# EAGLE design led_display_4x7_base_panel_for_AVR_v2 (EAGLE 5.10)
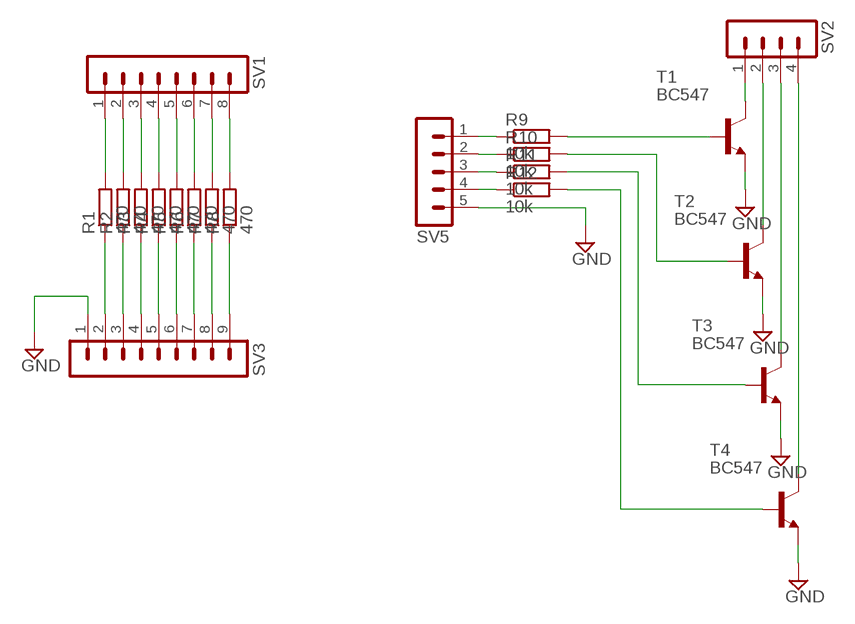
[diagram p0: schematic, sheet 1]

## Parts
R1  470  R-EU_0207/10  [0207/10]
R2  470  R-EU_0207/10  [0207/10]
R3  470  R-EU_0207/10  [0207/10]
R4  470  R-EU_0207/10  [0207/10]
R5  470  R-EU_0207/10  [0207/10]
R6  470  R-EU_0207/10  [0207/10]
R7  470  R-EU_0207/10  [0207/10]
R8  470  R-EU_0207/10  [0207/10]
R9  10k  R-EU_0207/10  [0207/10]
R10  10k  R-EU_0207/10  [0207/10]
R11  10k  R-EU_0207/10  [0207/10]
R12  10k  R-EU_0207/10  [0207/10]
SV1  MA08-1  [MA08-1]
SV2  MA04-1  [MA04-1]
SV3  MA09-1  [MA09-1]
SV5  MA05-1  [MA05-1]
T1  BC547  [TO92]
T2  BC547  [TO92]
T3  BC547  [TO92]
T4  BC547  [TO92]

## Nets
DIGIT_1_BASE: R9.2 T1.2(B)
DIGIT_1_IN: R9.1 SV5.1
DIGIT_1_N: SV2.1 T1.3(C)
DIGIT_2_BASE: R10.2 T2.2(B)
DIGIT_2_IN: R10.1 SV5.2
DIGIT_2_N: SV2.2 T2.3(C)
DIGIT_3_BASE: R11.2 T3.2(B)
DIGIT_3_IN: R11.1 SV5.3
DIGIT_3_N: SV2.3 T3.3(C)
DIGIT_4_BASE: R12.2 T4.2(B)
DIGIT_4_IN: R12.1 SV5.4
DIGIT_4_N: SV2.4 T4.3(C)
GND: SV3.1 SV5.5 T1.1(E) T2.1(E) T3.1(E) T4.1(E)
SEGMENT1: R1.2 SV1.1
SEGMENT1_1: R1.1 SV3.2
SEGMENT2: R2.2 SV1.2
SEGMENT2_1: R2.1 SV3.3
SEGMENT3: R3.2 SV1.3
SEGMENT3_1: R3.1 SV3.4
SEGMENT4: R4.2 SV1.4
SEGMENT4_1: R4.1 SV3.5
SEGMENT5: R5.2 SV1.5
SEGMENT5_1: R5.1 SV3.6
SEGMENT6: R6.2 SV1.6
SEGMENT6_1: R6.1 SV3.7
SEGMENT7: R7.2 SV1.7
SEGMENT7_1: R7.1 SV3.8
SEGMENT8: R8.2 SV1.8
SEGMENT8_1: R8.1 SV3.9

## Library data of the parts
R1-R12 = rcl:R-EU_: RESISTOR, European symbol
SV1 = con-lstb:MA08-1: PIN HEADER
SV2 = con-lstb:MA04-1: PIN HEADER
SV3 = con-lstb:MA09-1: PIN HEADER
SV5 = con-lstb:MA05-1: PIN HEADER
T1-T4 = transistor:BC547: NPN TRANSISTOR

## Board
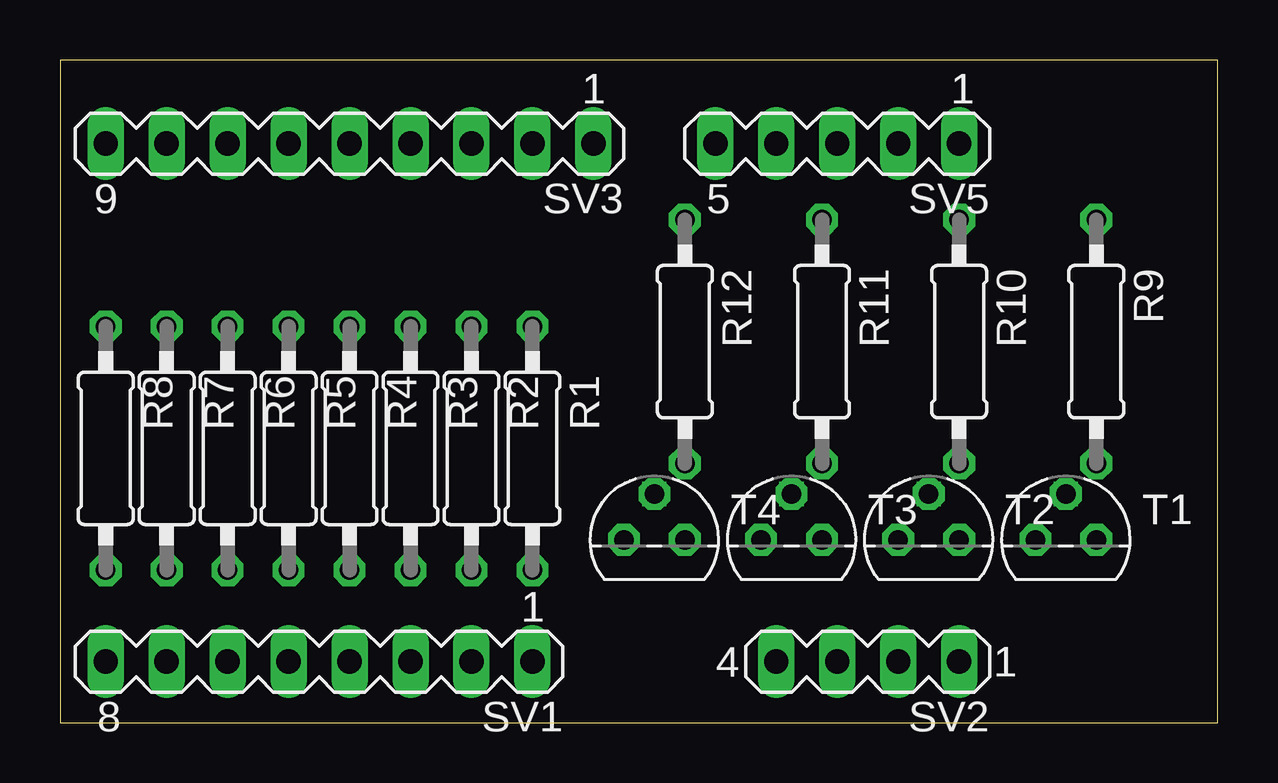
[diagram p1: board, top side]
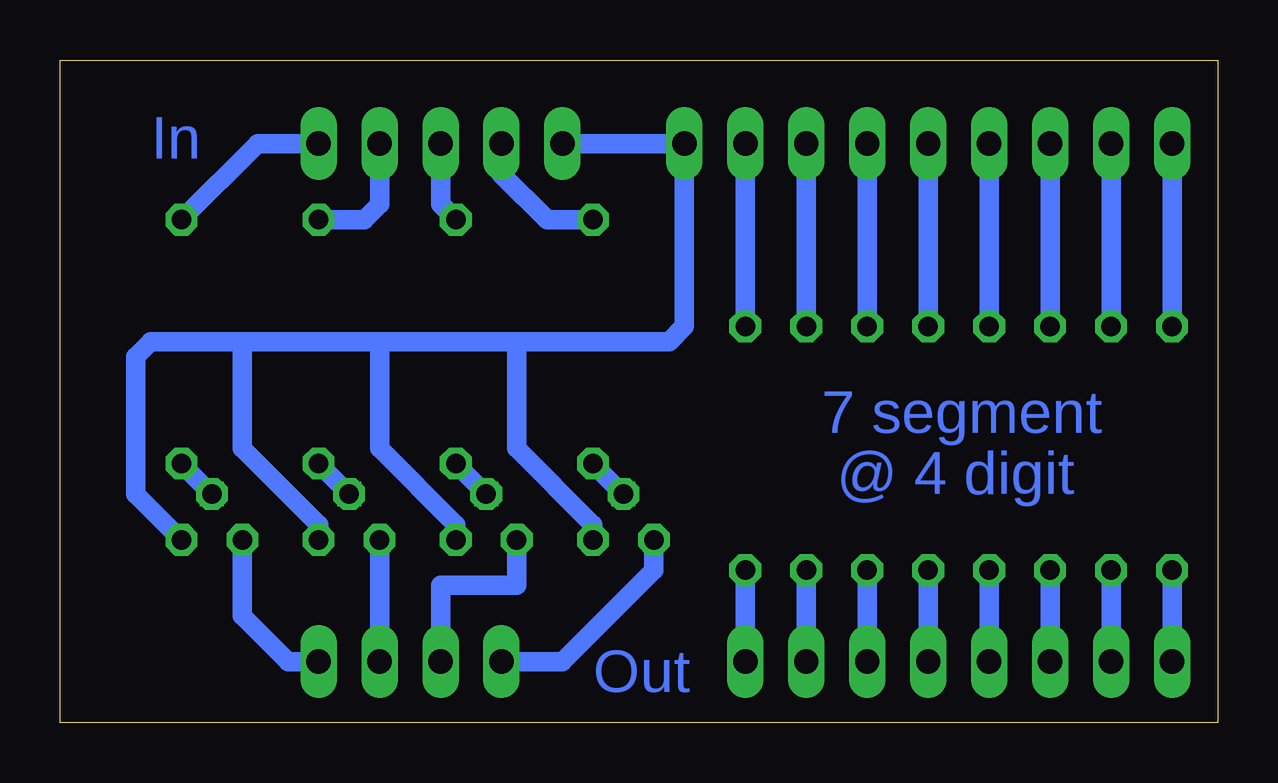
[diagram p2: board, bottom side, seen from below]

Size 48.24 x 27.61 mm. Coordinates in mm from the lower left corner, seen from the top.
Outline: 0,0 48.24,0 48.24,27.61 0,27.61 0,0
Copper layers (1*16): Top 0.035mm / dielectric 1.5mm / Bottom 0.035mm
Design rules "default": minimum track width 10mil, minimum drill 24mil, track to track 8mil, track to pad 8mil, pad to pad 8mil, via to via 8mil, smd to smd 8mil, copper to edge 40mil, drill to drill 8mil, minimum pad ring 10mil, minimum via ring 8mil, stop-mask expansion 4mil, vias tented up to drill 0mil, thermal gap 10mil

### Footprints (pad centres in the part's own frame; a part is rotated, then mirrored left to right if it is on the bottom)
0207/10 = drill 0.813 octagon: 1 -5.08,0; 2 5.08,0
MA08-1 = drill 1.016 long: 1 -8.89,0; 2 -6.35,0; 3 -3.81,0; 4 -1.27,0; 5 1.27,0; 6 3.81,0; 7 6.35,0; 8 8.89,0
MA04-1 = drill 1.016 long: 1 -3.81,0; 2 -1.27,0; 3 1.27,0; 4 3.81,0
MA09-1 = drill 1.016 long: 1 -10.16,0; 2 -7.62,0; 3 -5.08,0; 4 -2.54,0; 5 0,0; 6 2.54,0; 7 5.08,0; 8 7.62,0; 9 10.16,0
MA05-1 = drill 1.016 long: 1 -5.08,0; 2 -2.54,0; 3 0,0; 4 2.54,0; 5 5.08,0
TO92 = drill 0.813 octagon: 1 1.27,0; 2 0,1.905; 3 -1.27,0

### Placement (x,y rotation side)
R1  19.68,11.43 270 top
R2  17.14,11.43 270 top
R3  14.61,11.43 270 top
R4  12.06,11.43 270 top
R5  9.53,11.43 270 top
R6  6.99,11.43 270 top
R7  4.45,11.43 270 top
R8  1.91,11.43 270 top
R9  43.18,15.88 270 top
R10  37.47,15.88 270 top
R11  31.75,15.88 270 top
R12  26.04,15.88 270 top
SV1  10.79,2.54 180 top
SV2  33.66,2.54 180 top
SV3  12.06,24.13 180 top
SV5  32.38,24.13 180 top
T1  41.91,7.62 0 top
T2  36.2,7.62 0 top
T3  30.48,7.62 0 top
T4  24.77,7.62 0 top

### Tracks (layer width: path | path; a pad name or v marks a point on that pad's centre or on a via)
DIGIT_1_BASE  (via drill 0.6)
  Bottom 0.813: T1.2 R9.2
  other vias: 41.91,9.53
DIGIT_1_IN
  Bottom 0.813: SV5.1 40.01,24.13 R9.1
DIGIT_1_N
  Bottom 0.813: SV2.1 38.73,2.54 40.64,4.45 T1.3
DIGIT_2_BASE  (via drill 0.6)
  Bottom 0.813: T2.2 R10.2
  other vias: 36.2,9.53
DIGIT_2_IN
  Bottom 0.813: R10.1 35.56,20.95 34.92,21.59 SV5.2
DIGIT_2_N
  Bottom 0.813: T2.3 SV2.2
DIGIT_3_BASE  (via drill 0.6)
  Bottom 0.813: T3.2 R11.2
  other vias: 30.48,9.53
DIGIT_3_IN
  Bottom 0.813: R11.1 32.38,21.59 SV5.3
DIGIT_3_N
  Bottom 0.813: T3.3 29.21,5.71 32.38,5.71 SV2.3
DIGIT_4_BASE  (via drill 0.6)
  Bottom 0.813: T4.2 R12.2
  other vias: 24.77,9.53
DIGIT_4_IN
  Bottom 0.813: R12.1 27.94,20.95 29.84,22.86 SV5.4
DIGIT_4_N
  Bottom 0.813: SV2.4 27.3,2.54 23.5,6.35 T4.3
GND
  Bottom 0.813: SV5.5 SV3.1 22.23,16.51 22.86,15.88 29.21,15.88 | 29.21,15.88 34.92,15.88 | 34.92,15.88 40.64,15.88 | 40.64,15.88 44.45,15.88 45.09,15.24 45.09,9.53 T1.1 | T2.1 37.47,8.26 40.64,11.43 40.64,15.88 | T3.1 31.75,8.26 34.92,11.43 34.92,15.88 | T4.1 26.04,8.26 29.21,11.43 29.21,15.88
SEGMENT1
  Bottom 0.813: SV1.1 R1.2
SEGMENT1_1
  Bottom 0.813: R1.1 SV3.2
SEGMENT2
  Bottom 0.813: R2.2 SV1.2
SEGMENT2_1
  Bottom 0.813: SV3.3 R2.1
SEGMENT3
  Bottom 0.813: SV1.3 R3.2
SEGMENT3_1
  Bottom 0.813: SV3.4 R3.1
SEGMENT4
  Bottom 0.813: SV1.4 R4.2
SEGMENT4_1
  Bottom 0.813: SV3.5 R4.1
SEGMENT5
  Bottom 0.813: SV1.5 R5.2
SEGMENT5_1
  Bottom 0.813: SV3.6 R5.1
SEGMENT6
  Bottom 0.813: SV1.6 R6.2
SEGMENT6_1
  Bottom 0.813: SV3.7 R6.1
SEGMENT7
  Bottom 0.813: SV1.7 R7.2
SEGMENT7_1
  Bottom 0.813: SV3.8 R7.1
SEGMENT8
  Bottom 0.813: SV1.8 R8.2
SEGMENT8_1
  Bottom 0.813: SV3.9 R8.1

### Text on the board
Bottom: In | 7 segment | @ 4 digit | Out